# Altium schematic sheet Bluetooth LE BC118.SchDoc
size 209 x 297 mm; Author: Мурашкин Д.В.; Address1: Address1; Address2: Address2; Address3: Address3; Address4: Address4; DocumentNumber: АБВГ.123456.001 Э3; Scale: 1:1; Letter1Column: Э; PartName: Деталь
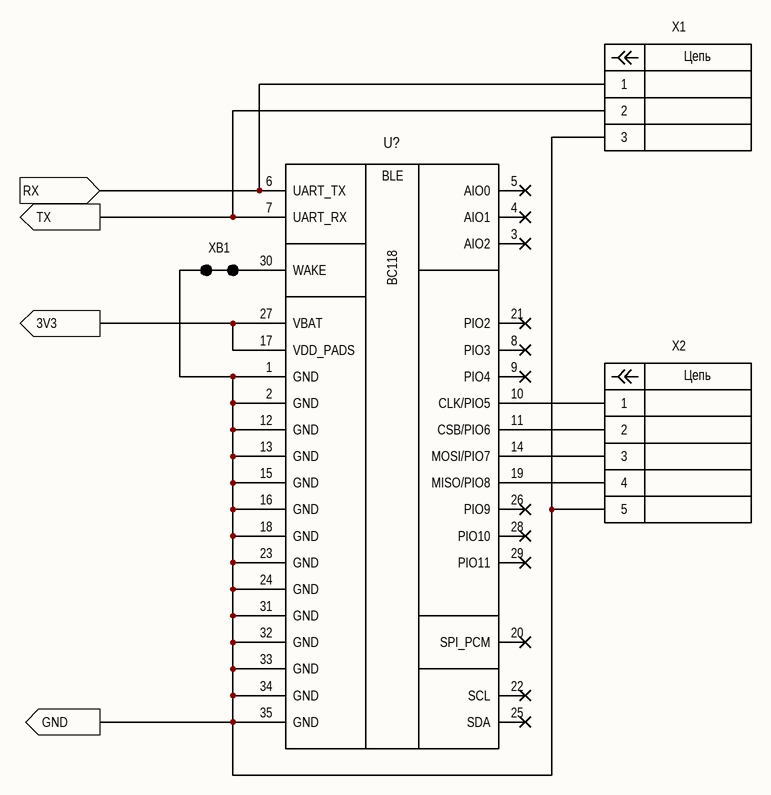
[diagram p0: Bluetooth LE BC118.SchDoc]

## Parts
U?  BC118  [BC118]
X1  USART connector  [USART connector]  (value not drawn)  (no BOM)
X2  B5B-XH-A  [B5B-XH-A]  (value not drawn)
XB1  Strap  [Strap 0.25mm 2012 connected]  (value not drawn)  (net tie, no BOM)

## Ports
3V3, GND, RX (in), TX (out)

## Nets
3V3: U?.17(VDD_PADS) U?.27(VBAT) ; port 3V3
GND: U?.1(GND) U?.2(GND) U?.12(GND) U?.13(GND) U?.15(GND) U?.16(GND) U?.18(GND) U?.23(GND) U?.24(GND) U?.31(GND) U?.32(GND) U?.33(GND) U?.34(GND) U?.35(GND) X1.3 X2.5 XB1.1 ; port GND
RX: U?.6(UART_TX) X1.1 ; port RX
TX: U?.7(UART_RX) X1.2 ; port TX
NetU?_10: U?.10(CLK/PIO5) X2.1
NetU?_11: U?.11(CSB/PIO6) X2.2
NetU?_14: U?.14(MOSI/PIO7) X2.3
NetU?_19: U?.19(MISO/PIO8) X2.4
NetU?_30: U?.30(WAKE) XB1.2

Not connected (* = marked no-connect by the designer): U? 3(AIO2)* 4(AIO1)* 5(AIO0)* 8(PIO3)* 9(PIO4)* 20(SPI_PCM)* 21(PIO2)* 22(SCL)* 25(SDA)* 26(PIO9)* 28(PIO10)* 29(PIO11)*

## Notes on the sheet
- Перв. примен.
- Справ. №
- Подп. и дата
- Инв. № дубл.
- Взам. инв. №
- Разраб.
- Изм.
- Лист
- № докум.
- Подп.
- Дата
- Лит.
- Масса
- Масштаб
- Пров.
- Т.контр.
- Листов
- Инв. № подл.
- Утв.
- Н.контр.
- 2.106-A4
- Копировал
- Формат А4
- (in symbol B5B-XH-A) Цепь
- (in symbol BC118) BLE
- (in symbol USART connector) Цепь

## Library data of the parts
U? = BC118: Bluetooth LE Module BC118 based on CSR1010; Manufacturer: BlueCreation; Group: Wireless; Package: BC118; Part name: BC118
X1 = USART connector: Debug USART Pads
X2 = B5B-XH-A: Header 2.54 5p Top; Manufacturer: JST Sales America Inc; Part name: B5B-XH-A(LF)(SN); Group: Rectangular Connectors - Headers, Male Pins; Package: 5 DIP 2.54